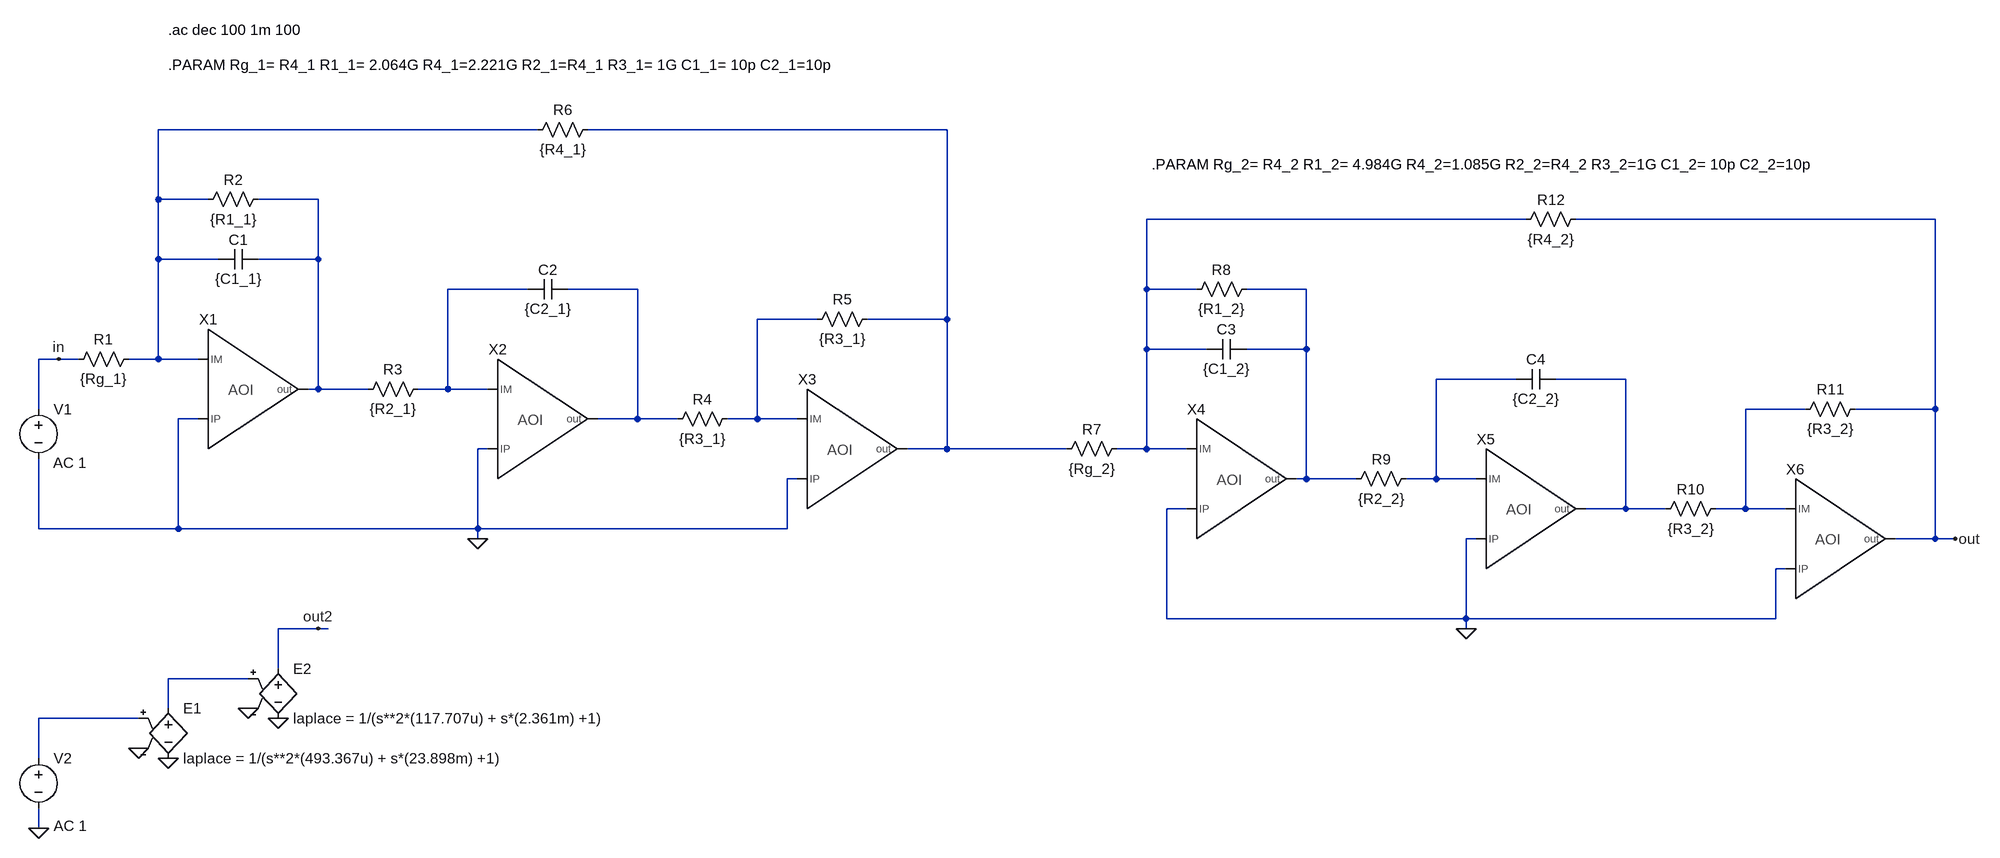
[diagram p0: schematic test_biquad_ideal.asc]
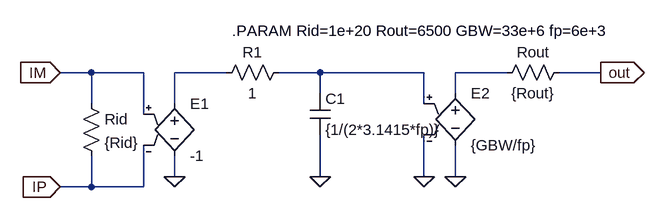
[diagram p1: sub-circuit ao_model.asc]
test_biquad_ideal.asc, the LTspice schematic file:
Version 4
SHEET 1 3432 1156
WIRE 1104 16 496 16
WIRE 1760 16 1184 16
WIRE 496 128 496 16
WIRE 576 128 496 128
WIRE 752 128 656 128
WIRE 2688 160 2080 160
WIRE 3344 160 2768 160
WIRE 496 224 496 128
WIRE 592 224 496 224
WIRE 752 224 752 128
WIRE 752 224 656 224
WIRE 1088 272 960 272
WIRE 1264 272 1152 272
WIRE 2080 272 2080 160
WIRE 2160 272 2080 272
WIRE 2336 272 2240 272
WIRE 1552 320 1456 320
WIRE 1760 320 1760 16
WIRE 1760 320 1632 320
WIRE 2080 368 2080 272
WIRE 2176 368 2080 368
WIRE 2336 368 2336 272
WIRE 2336 368 2240 368
WIRE 336 384 304 384
WIRE 368 384 336 384
WIRE 496 384 496 224
WIRE 496 384 448 384
WIRE 560 384 496 384
WIRE 2672 416 2544 416
WIRE 2848 416 2736 416
WIRE 752 432 752 224
WIRE 752 432 736 432
WIRE 832 432 752 432
WIRE 960 432 960 272
WIRE 960 432 912 432
WIRE 1024 432 960 432
WIRE 304 464 304 384
WIRE 3136 464 3040 464
WIRE 3344 464 3344 160
WIRE 3344 464 3216 464
WIRE 560 480 528 480
WIRE 1264 480 1264 272
WIRE 1264 480 1200 480
WIRE 1328 480 1264 480
WIRE 1456 480 1456 320
WIRE 1456 480 1408 480
WIRE 1520 480 1456 480
WIRE 1024 528 1008 528
WIRE 1760 528 1760 320
WIRE 1760 528 1696 528
WIRE 1952 528 1760 528
WIRE 2080 528 2080 368
WIRE 2080 528 2032 528
WIRE 2144 528 2080 528
WIRE 1520 576 1504 576
WIRE 2336 576 2336 368
WIRE 2336 576 2320 576
WIRE 2416 576 2336 576
WIRE 2544 576 2544 416
WIRE 2544 576 2496 576
WIRE 2608 576 2544 576
WIRE 2144 624 2112 624
WIRE 2848 624 2848 416
WIRE 2848 624 2784 624
WIRE 2912 624 2848 624
WIRE 3040 624 3040 464
WIRE 3040 624 2992 624
WIRE 3104 624 3040 624
WIRE 304 656 304 544
WIRE 528 656 528 480
WIRE 528 656 304 656
WIRE 1008 656 1008 528
WIRE 1008 656 528 656
WIRE 1504 656 1504 576
WIRE 1504 656 1008 656
WIRE 1008 672 1008 656
WIRE 2608 672 2592 672
WIRE 3344 672 3344 464
WIRE 3344 672 3280 672
WIRE 3376 672 3344 672
WIRE 3104 720 3088 720
WIRE 2112 800 2112 624
WIRE 2592 800 2592 672
WIRE 2592 800 2112 800
WIRE 3088 800 3088 720
WIRE 3088 800 2592 800
WIRE 752 816 688 816
WIRE 768 816 752 816
WIRE 2592 816 2592 800
WIRE 688 880 688 816
WIRE 640 896 512 896
WIRE 512 944 512 896
WIRE 464 960 304 960
WIRE 304 1024 304 960
WIRE 304 1136 304 1104
FLAG 336 384 in
FLAG 1008 672 0
FLAG 3376 672 out
FLAG 2592 816 0
FLAG 464 1008 0
FLAG 512 1024 0
FLAG 640 944 0
FLAG 688 960 0
FLAG 304 1136 0
FLAG 752 816 out2
SYMBOL cap 656 208 R90
WINDOW 0 0 32 VBottom 2
WINDOW 3 32 32 VTop 2
SYMATTR InstName C1
SYMATTR Value {C1_1}
SYMBOL voltage 304 448 R0
WINDOW 3 29 109 Left 2
WINDOW 123 23 102 Left 2
WINDOW 39 0 0 Left 2
SYMATTR Value ""
SYMATTR Value2 AC 1
SYMATTR InstName V1
SYMBOL res 464 368 R90
WINDOW 0 0 56 VBottom 2
WINDOW 3 32 56 VTop 2
SYMATTR InstName R1
SYMATTR Value {Rg_1}
SYMBOL ao_model 608 432 R0
SYMATTR InstName X1
SYMBOL res 672 112 R90
WINDOW 0 0 56 VBottom 2
WINDOW 3 32 56 VTop 2
SYMATTR InstName R2
SYMATTR Value {R1_1}
SYMBOL cap 1152 256 R90
WINDOW 0 0 32 VBottom 2
WINDOW 3 32 32 VTop 2
SYMATTR InstName C2
SYMATTR Value {C2_1}
SYMBOL ao_model 1072 480 R0
SYMATTR InstName X2
SYMBOL res 928 416 R90
WINDOW 0 0 56 VBottom 2
WINDOW 3 32 56 VTop 2
SYMATTR InstName R3
SYMATTR Value {R2_1}
SYMBOL ao_model 1568 528 R0
SYMATTR InstName X3
SYMBOL res 1424 464 R90
WINDOW 0 0 56 VBottom 2
WINDOW 3 32 56 VTop 2
SYMATTR InstName R4
SYMATTR Value {R3_1}
SYMBOL res 1648 304 R90
WINDOW 0 0 56 VBottom 2
WINDOW 3 32 56 VTop 2
SYMATTR InstName R5
SYMATTR Value {R3_1}
SYMBOL res 1200 0 R90
WINDOW 0 0 56 VBottom 2
WINDOW 3 32 56 VTop 2
SYMATTR InstName R6
SYMATTR Value {R4_1}
SYMBOL cap 2240 352 R90
WINDOW 0 0 32 VBottom 2
WINDOW 3 32 32 VTop 2
SYMATTR InstName C3
SYMATTR Value {C1_2}
SYMBOL res 2048 512 R90
WINDOW 0 0 56 VBottom 2
WINDOW 3 32 56 VTop 2
SYMATTR InstName R7
SYMATTR Value {Rg_2}
SYMBOL ao_model 2192 576 R0
SYMATTR InstName X4
SYMBOL res 2256 256 R90
WINDOW 0 0 56 VBottom 2
WINDOW 3 32 56 VTop 2
SYMATTR InstName R8
SYMATTR Value {R1_2}
SYMBOL cap 2736 400 R90
WINDOW 0 0 32 VBottom 2
WINDOW 3 32 32 VTop 2
SYMATTR InstName C4
SYMATTR Value {C2_2}
SYMBOL ao_model 2656 624 R0
SYMATTR InstName X5
SYMBOL res 2512 560 R90
WINDOW 0 0 56 VBottom 2
WINDOW 3 32 56 VTop 2
SYMATTR InstName R9
SYMATTR Value {R2_2}
SYMBOL ao_model 3152 672 R0
SYMATTR InstName X6
SYMBOL res 3008 608 R90
WINDOW 0 0 56 VBottom 2
WINDOW 3 32 56 VTop 2
SYMATTR InstName R10
SYMATTR Value {R3_2}
SYMBOL res 3232 448 R90
WINDOW 0 0 56 VBottom 2
WINDOW 3 32 56 VTop 2
SYMATTR InstName R11
SYMATTR Value {R3_2}
SYMBOL res 2784 144 R90
WINDOW 0 0 56 VBottom 2
WINDOW 3 32 56 VTop 2
SYMATTR InstName R12
SYMATTR Value {R4_2}
SYMBOL e 512 928 R0
SYMATTR InstName E1
SYMATTR Value laplace = 1/(s**2*(493.367u) + s*(23.898m) +1)
SYMBOL e 688 864 R0
SYMATTR InstName E2
SYMATTR Value laplace = 1/(s**2*(117.707u) + s*(2.361m) +1)
SYMBOL voltage 304 1008 R0
WINDOW 123 24 124 Left 2
WINDOW 39 0 0 Left 0
WINDOW 3 24 44 Left 2
SYMATTR Value2 AC 1
SYMATTR Value ""
SYMATTR InstName V2
TEXT 512 -88 Left 2 !.PARAM Rg_1= R4_1 R1_1= 2.064G R4_1=2.221G R2_1=R4_1 R3_1= 1G C1_1= 10p C2_1=10p
TEXT 2088 72 Left 2 !.PARAM Rg_2= R4_2 R1_2= 4.984G R4_2=1.085G R2_2=R4_2 R3_2=1G C1_2= 10p C2_2=10p
TEXT 512 -144 Left 2 !.ac dec 100 1m 100

ao_model.asc, the sub-circuit schematic file:
Version 4
SHEET 1 880 852
WIRE -80 352 -128 352
WIRE 0 352 -80 352
WIRE 128 352 48 352
WIRE 272 352 208 352
WIRE 432 352 272 352
WIRE 560 352 480 352
WIRE 704 352 640 352
WIRE 272 384 272 352
WIRE 480 384 480 352
WIRE -80 400 -80 352
WIRE 48 400 48 352
WIRE 432 400 432 352
WIRE 0 416 0 352
WIRE 48 512 48 480
WIRE 272 512 272 448
WIRE 432 512 432 448
WIRE 480 512 480 464
WIRE -80 528 -80 480
WIRE -80 528 -128 528
WIRE 0 528 0 464
WIRE 0 528 -80 528
FLAG -128 352 IM
IOPIN -128 352 In
FLAG -128 528 IP
IOPIN -128 528 In
FLAG 48 512 0
FLAG 272 512 0
FLAG 432 512 0
FLAG 480 512 0
FLAG 704 352 out
IOPIN 704 352 Out
SYMBOL e 48 384 R0
SYMATTR InstName E1
SYMATTR Value -1
SYMBOL res 224 336 R90
WINDOW 0 0 56 VBottom 2
WINDOW 3 32 56 VTop 2
SYMATTR InstName R1
SYMATTR Value 1
SYMBOL res -96 384 R0
SYMATTR InstName Rid
SYMATTR Value {Rid}
SYMBOL cap 256 384 R0
SYMATTR InstName C1
SYMATTR Value {1/(2*3.1415*fp)}
SYMBOL e 480 368 R0
SYMATTR InstName E2
SYMATTR Value {GBW/fp}
SYMBOL res 656 336 R90
WINDOW 0 0 56 VBottom 2
WINDOW 3 32 56 VTop 2
SYMATTR InstName Rout
SYMATTR Value {Rout}
TEXT 136 288 Left 2 !.PARAM Rid=1e+20 Rout=6500 GBW=33e+6 fp=6e+3

The netlist it stands for:
* test_biquad_ideal.asc
C1 N003 N001 {C1_1}
V1 in 0 AC 1
R1 N001 in {Rg_1}
XX1 N001 0 N003 ao_model
R2 N003 N001 {R1_1}
C2 N006 N005 {C2_1}
XX2 N005 0 N006 ao_model
R3 N005 N003 {R2_1}
XX3 N008 0 N002 ao_model
R4 N008 N006 {R3_1}
R5 N002 N008 {R3_1}
R6 N002 N001 {R4_1}
C3 N007 N004 {C1_2}
R7 N004 N002 {Rg_2}
XX4 N004 0 N007 ao_model
R8 N007 N004 {R1_2}
C4 N010 N009 {C2_2}
XX5 N009 0 N010 ao_model
R9 N009 N007 {R2_2}
XX6 N011 0 out ao_model
R10 N011 N010 {R3_2}
R11 out N011 {R3_2}
R12 out N004 {R4_2}
E1 N012 0 N013 0 laplace = 1/(s**2*(493.367u) + s*(23.898m) +1)
E2 out2 0 N012 0 laplace = 1/(s**2*(117.707u) + s*(2.361m) +1)
V2 N013 0 AC 1

* block symbol definitions
.subckt ao_model IM IP out
E1 N001 0 IM IP -1
R1 N002 N001 1
Rid IM IP {Rid}
C1 N002 0 {1/(2*3.1415*fp)}
E2 N003 0 N002 0 {GBW/fp}
Rout out N003 {Rout}
.PARAM Rid=1e+20 Rout=6500 GBW=33e+6 fp=6e+3
.ends ao_model

.PARAM Rg_1= R4_1 R1_1= 2.064G R4_1=2.221G R2_1=R4_1 R3_1= 1G C1_1= 10p C2_1=10p
.PARAM Rg_2= R4_2 R1_2= 4.984G R4_2=1.085G R2_2=R4_2 R3_2=1G C1_2= 10p C2_2=10p
.ac dec 100 1m 100
.backanno
.end

* Results of the author's LTspice run, read from the files saved beside the schematic
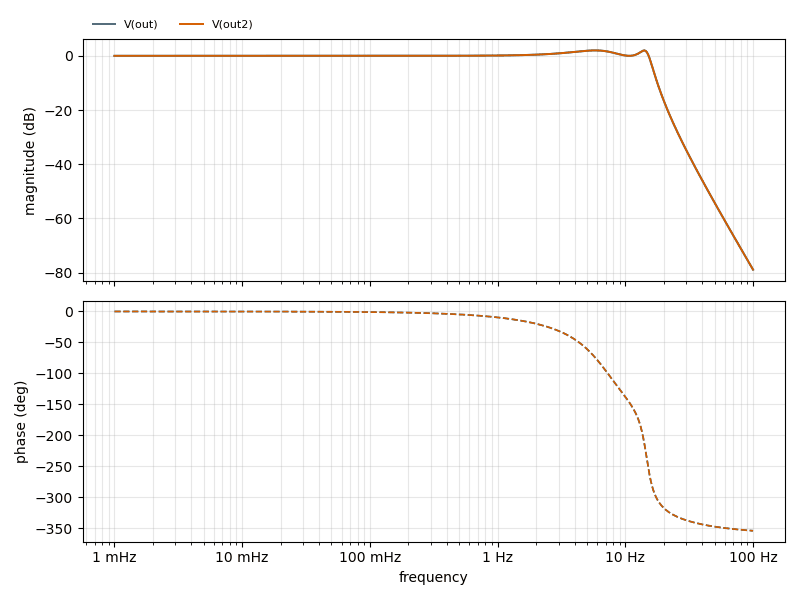
[diagram p2: AC Analysis of test_biquad_ideal.asc, plotted from the saved traces]
* AC Analysis, 1 run:
*   V(out): -0.00 dB at 1 mHz, -78.94 dB at 100 Hz, peak 1.99 dB at 5.754 Hz, 3 dB below the peak at 15.49 Hz
*   V(out2): 0.00 dB at 1 mHz, -78.93 dB at 100 Hz, peak 2.00 dB at 5.888 Hz, 3 dB below the peak at 15.5 Hz